# Altium schematic sheet 22_LMS2_TX_BB_DACs.SchDoc: LMS2 TX BB DACs
size A3; Organization: Lime Microsystems; Address1: Surrey Tech Centre; Address2: Guildford GU2 7YG; Address3: Surrey; Address4: United Kingdom; Revision: v1.0; SheetNumber: 22; SheetTotal: 31
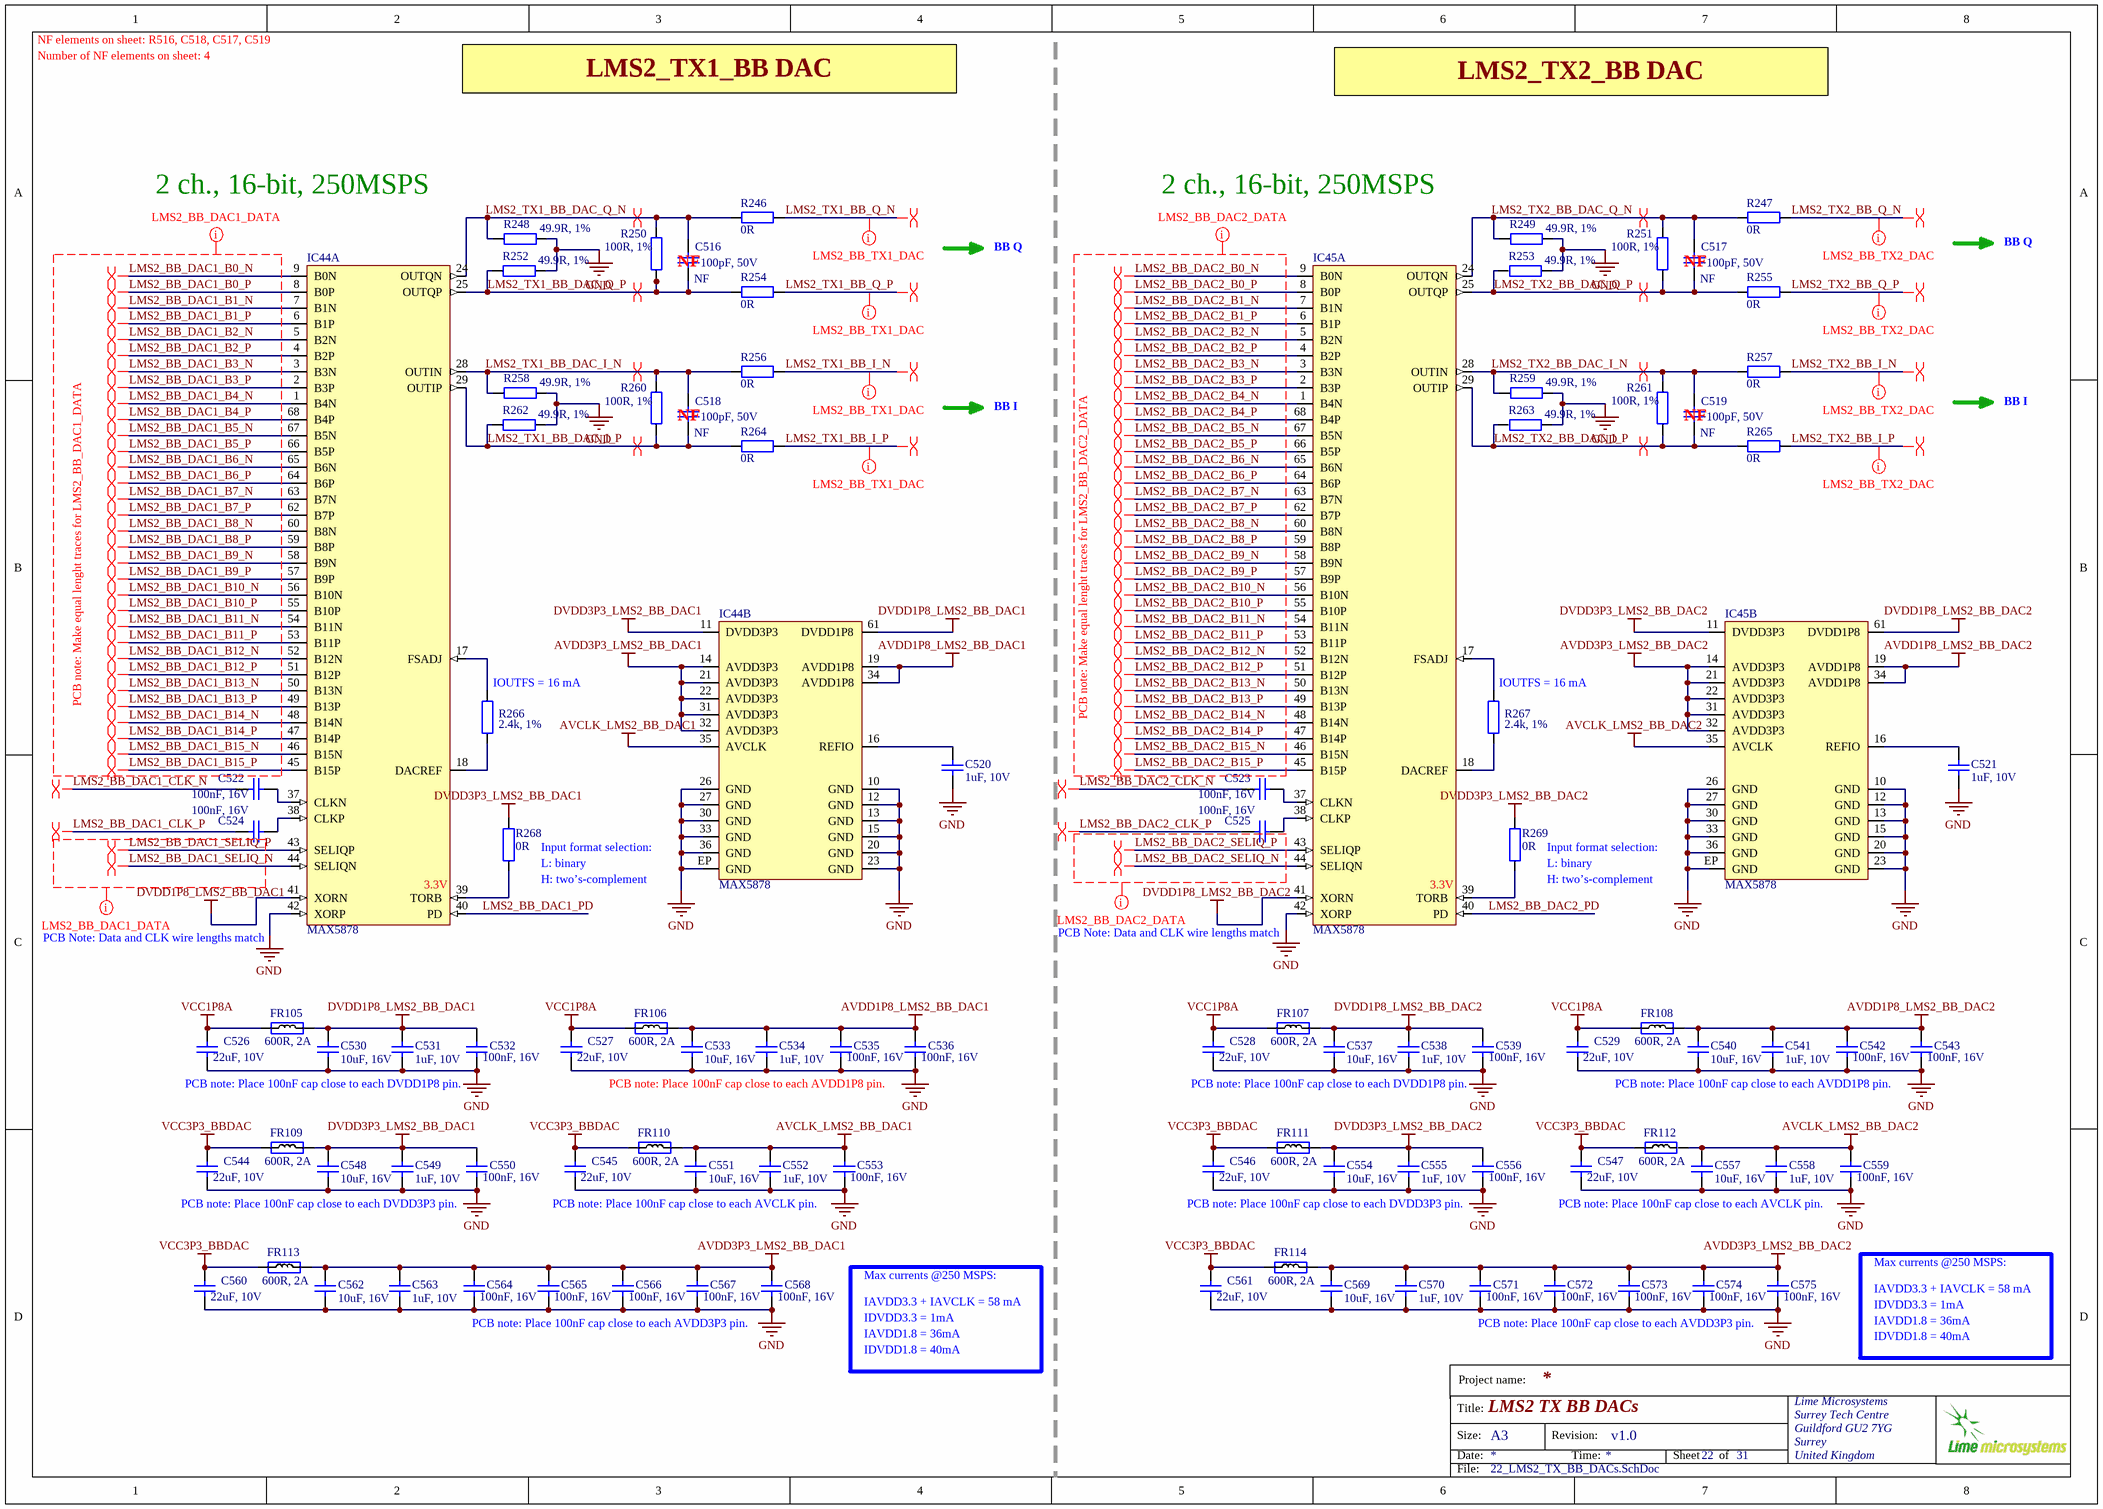
[diagram p0: 22_LMS2_TX_BB_DACs.SchDoc]

## Parts
C516  100pF, 50V  Assembly Info: NF  [CAP0402]
C517  100pF, 50V  Assembly Info: NF  [CAP0402]
C518  100pF, 50V  Assembly Info: NF  [CAP0402]
C519  100pF, 50V  Assembly Info: NF  [CAP0402]
C520  1uF, 10V  [CAP0402]
C521  1uF, 10V  [CAP0402]
C522  100nF, 16V  [CAP0402]
C523  100nF, 16V  [CAP0402]
C524  100nF, 16V  [CAP0402]
C525  100nF, 16V  [CAP0402]
C526  22uF, 10V  [CAP0603]
C527  22uF, 10V  [CAP0603]
C528  22uF, 10V  [CAP0603]
C529  22uF, 10V  [CAP0603]
C530  10uF, 16V  [CAP0603]
C531  1uF, 10V  [CAP0402]
C532  100nF, 16V  [CAP0402]
C533  10uF, 16V  [CAP0603]
C534  1uF, 10V  [CAP0402]
C535  100nF, 16V  [CAP0402]
C536  100nF, 16V  [CAP0402]
C537  10uF, 16V  [CAP0603]
C538  1uF, 10V  [CAP0402]
C539  100nF, 16V  [CAP0402]
C540  10uF, 16V  [CAP0603]
C541  1uF, 10V  [CAP0402]
C542  100nF, 16V  [CAP0402]
C543  100nF, 16V  [CAP0402]
C544  22uF, 10V  [CAP0603]
C545  22uF, 10V  [CAP0603]
C546  22uF, 10V  [CAP0603]
C547  22uF, 10V  [CAP0603]
C548  10uF, 16V  [CAP0603]
C549  1uF, 10V  [CAP0402]
C550  100nF, 16V  [CAP0402]
C551  10uF, 16V  [CAP0603]
C552  1uF, 10V  [CAP0402]
C553  100nF, 16V  [CAP0402]
C554  10uF, 16V  [CAP0603]
C555  1uF, 10V  [CAP0402]
C556  100nF, 16V  [CAP0402]
C557  10uF, 16V  [CAP0603]
C558  1uF, 10V  [CAP0402]
C559  100nF, 16V  [CAP0402]
C560  22uF, 10V  [CAP0603]
C561  22uF, 10V  [CAP0603]
C562  10uF, 16V  [CAP0603]
C563  1uF, 10V  [CAP0402]
C564  100nF, 16V  [CAP0402]
C565  100nF, 16V  [CAP0402]
C566  100nF, 16V  [CAP0402]
C567  100nF, 16V  [CAP0402]
C568  100nF, 16V  [CAP0402]
C569  10uF, 16V  [CAP0603]
C570  1uF, 10V  [CAP0402]
C571  100nF, 16V  [CAP0402]
C572  100nF, 16V  [CAP0402]
C573  100nF, 16V  [CAP0402]
C574  100nF, 16V  [CAP0402]
C575  100nF, 16V  [CAP0402]
FR105  600R, 2A  [RES0805]
FR106  600R, 2A  [RES0805]
FR107  600R, 2A  [RES0805]
FR108  600R, 2A  [RES0805]
FR109  600R, 2A  [RES0805]
FR110  600R, 2A  [RES0805]
FR111  600R, 2A  [RES0805]
FR112  600R, 2A  [RES0805]
FR113  600R, 2A  [RES0805]
FR114  600R, 2A  [RES0805]
IC44  MAX5878  [MAX5878_QFN68]  (parts A,B of 2)
IC45  MAX5878  [MAX5878_QFN68]  (parts A,B of 2)
R246  0R  [RES0402]
R247  0R  [RES0402]
R248  49.9R, 1%  [RES0402]
R249  49.9R, 1%  [RES0402]
R250  100R, 1%  [RES0402]
R251  100R, 1%  [RES0402]
R252  49.9R, 1%  [RES0402]
R253  49.9R, 1%  [RES0402]
R254  0R  [RES0402]
R255  0R  [RES0402]
R256  0R  [RES0402]
R257  0R  [RES0402]
R258  49.9R, 1%  [RES0402]
R259  49.9R, 1%  [RES0402]
R260  100R, 1%  [RES0402]
R261  100R, 1%  [RES0402]
R262  49.9R, 1%  [RES0402]
R263  49.9R, 1%  [RES0402]
R264  0R  [RES0402]
R265  0R  [RES0402]
R266  2.4k, 1%  [RES0402]
R267  2.4k, 1%  [RES0402]
R268  0R  [RES0402]
R269  0R  [RES0402]

## Nets
AVCLK_LMS2_BB_DAC1: C551.2 C552.2 C553.2 FR110.2 IC44.35(AVCLK)
AVCLK_LMS2_BB_DAC2: C557.2 C558.2 C559.2 FR112.2 IC45.35(AVCLK)
AVDD1P8_LMS2_BB_DAC1: C533.2 C534.2 C535.2 C536.2 FR106.2 IC44.19(AVDD1P8) IC44.34(AVDD1P8)
AVDD1P8_LMS2_BB_DAC2: C540.2 C541.2 C542.2 C543.2 FR108.2 IC45.19(AVDD1P8) IC45.34(AVDD1P8)
AVDD3P3_LMS2_BB_DAC1: C562.2 C563.2 C564.2 C565.2 C566.2 C567.2 C568.2 FR113.2 IC44.14(AVDD3P3) IC44.21(AVDD3P3) IC44.22(AVDD3P3) IC44.31(AVDD3P3) IC44.32(AVDD3P3)
AVDD3P3_LMS2_BB_DAC2: C569.2 C570.2 C571.2 C572.2 C573.2 C574.2 C575.2 FR114.2 IC45.14(AVDD3P3) IC45.21(AVDD3P3) IC45.22(AVDD3P3) IC45.31(AVDD3P3) IC45.32(AVDD3P3)
DVDD1P8_LMS2_BB_DAC1: C530.2 C531.2 C532.2 FR105.2 IC44.41(XORN) IC44.61(DVDD1P8)
DVDD1P8_LMS2_BB_DAC2: C537.2 C538.2 C539.2 FR107.2 IC45.41(XORN) IC45.61(DVDD1P8)
DVDD3P3_LMS2_BB_DAC1: C548.2 C549.2 C550.2 FR109.2 IC44.11(DVDD3P3) R268.2
DVDD3P3_LMS2_BB_DAC2: C554.2 C555.2 C556.2 FR111.2 IC45.11(DVDD3P3) R269.2
GND: C520.1 C521.1 C526.1 C527.1 C528.1 C529.1 C530.1 C531.1 C532.1 C533.1 C534.1 C535.1 C536.1 C537.1 C538.1 C539.1 C540.1 C541.1 C542.1 C543.1 C544.1 C545.1 C546.1 C547.1 C548.1 C549.1 C550.1 C551.1 C552.1 C553.1 C554.1 C555.1 C556.1 C557.1 C558.1 C559.1 C560.1 C561.1 C562.1 C563.1 C564.1 C565.1 C566.1 C567.1 C568.1 C569.1 C570.1 C571.1 C572.1 C573.1 C574.1 C575.1 IC44.10(GND) IC44.12(GND) IC44.13(GND) IC44.15(GND) IC44.20(GND) IC44.23(GND) IC44.26(GND) IC44.27(GND) IC44.30(GND) IC44.33(GND) IC44.36(GND) IC44.42(XORP) IC44.EP(GND) IC45.10(GND) IC45.12(GND) IC45.13(GND) IC45.15(GND) IC45.20(GND) IC45.23(GND) IC45.26(GND) IC45.27(GND) IC45.30(GND) IC45.33(GND) IC45.36(GND) IC45.42(XORP) IC45.EP(GND) R248.1 R249.1 R252.1 R253.1 R258.1 R259.1 R262.1 R263.1
VCC1P8A: C526.2 C527.2 C528.2 C529.2 FR105.1 FR106.1 FR107.1 FR108.1
VCC3P3_BBDAC: C544.2 C545.2 C546.2 C547.2 C560.2 C561.2 FR109.1 FR110.1 FR111.1 FR112.1 FR113.1 FR114.1
LMS2_BB_DAC1_B0_N: IC44.9(B0N)
LMS2_BB_DAC1_B0_P: IC44.8(B0P)
LMS2_BB_DAC1_B1_N: IC44.7(B1N)
LMS2_BB_DAC1_B1_P: IC44.6(B1P)
LMS2_BB_DAC1_B2_N: IC44.5(B2N)
LMS2_BB_DAC1_B2_P: IC44.4(B2P)
LMS2_BB_DAC1_B3_N: IC44.3(B3N)
LMS2_BB_DAC1_B3_P: IC44.2(B3P)
LMS2_BB_DAC1_B4_N: IC44.1(B4N)
LMS2_BB_DAC1_B4_P: IC44.68(B4P)
LMS2_BB_DAC1_B5_N: IC44.67(B5N)
LMS2_BB_DAC1_B5_P: IC44.66(B5P)
LMS2_BB_DAC1_B6_N: IC44.65(B6N)
LMS2_BB_DAC1_B6_P: IC44.64(B6P)
LMS2_BB_DAC1_B7_N: IC44.63(B7N)
LMS2_BB_DAC1_B7_P: IC44.62(B7P)
LMS2_BB_DAC1_B8_N: IC44.60(B8N)
LMS2_BB_DAC1_B8_P: IC44.59(B8P)
LMS2_BB_DAC1_B9_N: IC44.58(B9N)
LMS2_BB_DAC1_B9_P: IC44.57(B9P)
LMS2_BB_DAC1_B10_N: IC44.56(B10N)
LMS2_BB_DAC1_B10_P: IC44.55(B10P)
LMS2_BB_DAC1_B11_N: IC44.54(B11N)
LMS2_BB_DAC1_B11_P: IC44.53(B11P)
LMS2_BB_DAC1_B12_N: IC44.52(B12N)
LMS2_BB_DAC1_B12_P: IC44.51(B12P)
LMS2_BB_DAC1_B13_N: IC44.50(B13N)
LMS2_BB_DAC1_B13_P: IC44.49(B13P)
LMS2_BB_DAC1_B14_N: IC44.48(B14N)
LMS2_BB_DAC1_B14_P: IC44.47(B14P)
LMS2_BB_DAC1_B15_N: IC44.46(B15N)
LMS2_BB_DAC1_B15_P: IC44.45(B15P)
LMS2_BB_DAC1_CLK_N: C522.2
LMS2_BB_DAC1_CLK_P: C524.2
LMS2_BB_DAC1_PD: IC44.40(PD)
LMS2_BB_DAC1_SELIQ_N: IC44.44(SELIQN)
LMS2_BB_DAC1_SELIQ_P: IC44.43(SELIQP)
LMS2_BB_DAC2_B0_N: IC45.9(B0N)
LMS2_BB_DAC2_B0_P: IC45.8(B0P)
LMS2_BB_DAC2_B1_N: IC45.7(B1N)
LMS2_BB_DAC2_B1_P: IC45.6(B1P)
LMS2_BB_DAC2_B2_N: IC45.5(B2N)
LMS2_BB_DAC2_B2_P: IC45.4(B2P)
LMS2_BB_DAC2_B3_N: IC45.3(B3N)
LMS2_BB_DAC2_B3_P: IC45.2(B3P)
LMS2_BB_DAC2_B4_N: IC45.1(B4N)
LMS2_BB_DAC2_B4_P: IC45.68(B4P)
LMS2_BB_DAC2_B5_N: IC45.67(B5N)
LMS2_BB_DAC2_B5_P: IC45.66(B5P)
LMS2_BB_DAC2_B6_N: IC45.65(B6N)
LMS2_BB_DAC2_B6_P: IC45.64(B6P)
LMS2_BB_DAC2_B7_N: IC45.63(B7N)
LMS2_BB_DAC2_B7_P: IC45.62(B7P)
LMS2_BB_DAC2_B8_N: IC45.60(B8N)
LMS2_BB_DAC2_B8_P: IC45.59(B8P)
LMS2_BB_DAC2_B9_N: IC45.58(B9N)
LMS2_BB_DAC2_B9_P: IC45.57(B9P)
LMS2_BB_DAC2_B10_N: IC45.56(B10N)
LMS2_BB_DAC2_B10_P: IC45.55(B10P)
LMS2_BB_DAC2_B11_N: IC45.54(B11N)
LMS2_BB_DAC2_B11_P: IC45.53(B11P)
LMS2_BB_DAC2_B12_N: IC45.52(B12N)
LMS2_BB_DAC2_B12_P: IC45.51(B12P)
LMS2_BB_DAC2_B13_N: IC45.50(B13N)
LMS2_BB_DAC2_B13_P: IC45.49(B13P)
LMS2_BB_DAC2_B14_N: IC45.48(B14N)
LMS2_BB_DAC2_B14_P: IC45.47(B14P)
LMS2_BB_DAC2_B15_N: IC45.46(B15N)
LMS2_BB_DAC2_B15_P: IC45.45(B15P)
LMS2_BB_DAC2_CLK_N: C523.2
LMS2_BB_DAC2_CLK_P: C525.2
LMS2_BB_DAC2_PD: IC45.40(PD)
LMS2_BB_DAC2_SELIQ_N: IC45.44(SELIQN)
LMS2_BB_DAC2_SELIQ_P: IC45.43(SELIQP)
LMS2_TX1_BB_DAC_I_N: C518.1 IC44.28(OUTIN) R256.1 R258.2 R260.1
LMS2_TX1_BB_DAC_I_P: C518.2 IC44.29(OUTIP) R260.2 R262.2 R264.1
LMS2_TX1_BB_DAC_Q_N: C516.1 IC44.24(OUTQN) R246.1 R248.2 R250.1
LMS2_TX1_BB_DAC_Q_P: C516.2 IC44.25(OUTQP) R250.2 R252.2 R254.1
LMS2_TX1_BB_I_N: R256.2
LMS2_TX1_BB_I_P: R264.2
LMS2_TX1_BB_Q_N: R246.2
LMS2_TX1_BB_Q_P: R254.2
LMS2_TX2_BB_DAC_I_N: C519.1 IC45.28(OUTIN) R257.1 R259.2 R261.1
LMS2_TX2_BB_DAC_I_P: C519.2 IC45.29(OUTIP) R261.2 R263.2 R265.1
LMS2_TX2_BB_DAC_Q_N: C517.1 IC45.24(OUTQN) R247.1 R249.2 R251.1
LMS2_TX2_BB_DAC_Q_P: C517.2 IC45.25(OUTQP) R251.2 R253.2 R255.1
LMS2_TX2_BB_I_N: R257.2
LMS2_TX2_BB_I_P: R265.2
LMS2_TX2_BB_Q_N: R247.2
LMS2_TX2_BB_Q_P: R255.2
NetC520_2: C520.2 IC44.16(REFIO)
NetC521_2: C521.2 IC45.16(REFIO)
NetC522_1: C522.1 IC44.37(CLKN)
NetC523_1: C523.1 IC45.37(CLKN)
NetC524_1: C524.1 IC44.38(CLKP)
NetC525_1: C525.1 IC45.38(CLKP)
NetIC44_17: IC44.17(FSADJ) R266.2
NetIC44_18: IC44.18(DACREF) R266.1
NetIC44_39: IC44.39(TORB) R268.1
NetIC45_17: IC45.17(FSADJ) R267.2
NetIC45_18: IC45.18(DACREF) R267.1
NetIC45_39: IC45.39(TORB) R269.1

## Layout directives
differential pair: LMS2_BB_DAC1_B0_N, LMS2_BB_DAC1_B0_P, LMS2_BB_DAC1_B1_N, LMS2_BB_DAC1_B1_P, LMS2_BB_DAC1_B2_N, LMS2_BB_DAC1_B2_P, LMS2_BB_DAC1_B3_N, LMS2_BB_DAC1_B3_P, LMS2_BB_DAC1_B4_N, LMS2_BB_DAC1_B4_P, LMS2_BB_DAC1_B5_N, LMS2_BB_DAC1_B5_P, LMS2_BB_DAC1_B6_N, LMS2_BB_DAC1_B6_P, LMS2_BB_DAC1_B7_N, LMS2_BB_DAC1_B7_P, LMS2_BB_DAC1_B8_N, LMS2_BB_DAC1_B8_P, LMS2_BB_DAC1_B9_N, LMS2_BB_DAC1_B9_P, LMS2_BB_DAC1_B10_N, LMS2_BB_DAC1_B10_P, LMS2_BB_DAC1_B11_N, LMS2_BB_DAC1_B11_P, LMS2_BB_DAC1_B12_N, LMS2_BB_DAC1_B12_P, LMS2_BB_DAC1_B13_N, LMS2_BB_DAC1_B13_P, LMS2_BB_DAC1_B14_N, LMS2_BB_DAC1_B14_P, LMS2_BB_DAC1_B15_N, LMS2_BB_DAC1_B15_P, LMS2_BB_DAC1_CLK_N, LMS2_BB_DAC1_CLK_P, LMS2_BB_DAC1_SELIQ_N, LMS2_BB_DAC1_SELIQ_P, LMS2_BB_DAC2_B0_N, LMS2_BB_DAC2_B0_P, LMS2_BB_DAC2_B1_N, LMS2_BB_DAC2_B1_P, LMS2_BB_DAC2_B2_N, LMS2_BB_DAC2_B2_P, LMS2_BB_DAC2_B3_N, LMS2_BB_DAC2_B3_P, LMS2_BB_DAC2_B4_N, LMS2_BB_DAC2_B4_P, LMS2_BB_DAC2_B5_N, LMS2_BB_DAC2_B5_P, LMS2_BB_DAC2_B6_N, LMS2_BB_DAC2_B6_P, LMS2_BB_DAC2_B7_N, LMS2_BB_DAC2_B7_P, LMS2_BB_DAC2_B8_N, LMS2_BB_DAC2_B8_P, LMS2_BB_DAC2_B9_N, LMS2_BB_DAC2_B9_P, LMS2_BB_DAC2_B10_N, LMS2_BB_DAC2_B10_P, LMS2_BB_DAC2_B11_N, LMS2_BB_DAC2_B11_P, LMS2_BB_DAC2_B12_N, LMS2_BB_DAC2_B12_P, LMS2_BB_DAC2_B13_N, LMS2_BB_DAC2_B13_P, LMS2_BB_DAC2_B14_N, LMS2_BB_DAC2_B14_P, LMS2_BB_DAC2_B15_N, LMS2_BB_DAC2_B15_P, LMS2_BB_DAC2_CLK_N, LMS2_BB_DAC2_CLK_P, LMS2_BB_DAC2_SELIQ_N, LMS2_BB_DAC2_SELIQ_P, LMS2_TX1_BB_DAC_I_N, LMS2_TX1_BB_DAC_I_P, LMS2_TX1_BB_DAC_Q_N, LMS2_TX1_BB_DAC_Q_P, LMS2_TX1_BB_I_N, LMS2_TX1_BB_I_P, LMS2_TX1_BB_Q_N, LMS2_TX1_BB_Q_P, LMS2_TX2_BB_DAC_I_N, LMS2_TX2_BB_DAC_I_P, LMS2_TX2_BB_DAC_Q_N, LMS2_TX2_BB_DAC_Q_P, LMS2_TX2_BB_I_N, LMS2_TX2_BB_I_P, LMS2_TX2_BB_Q_N, LMS2_TX2_BB_Q_P
net class LMS2_BB_DAC1_DATA: LMS2_BB_DAC1_B0_N, LMS2_BB_DAC1_B0_P, LMS2_BB_DAC1_B1_N, LMS2_BB_DAC1_B1_P, LMS2_BB_DAC1_B2_N, LMS2_BB_DAC1_B2_P, LMS2_BB_DAC1_B3_N, LMS2_BB_DAC1_B3_P, LMS2_BB_DAC1_B4_N, LMS2_BB_DAC1_B4_P, LMS2_BB_DAC1_B5_N, LMS2_BB_DAC1_B5_P, LMS2_BB_DAC1_B6_N, LMS2_BB_DAC1_B6_P, LMS2_BB_DAC1_B7_N, LMS2_BB_DAC1_B7_P, LMS2_BB_DAC1_B8_N, LMS2_BB_DAC1_B8_P, LMS2_BB_DAC1_B9_N, LMS2_BB_DAC1_B9_P, LMS2_BB_DAC1_B10_N, LMS2_BB_DAC1_B10_P, LMS2_BB_DAC1_B11_N, LMS2_BB_DAC1_B11_P, LMS2_BB_DAC1_B12_N, LMS2_BB_DAC1_B12_P, LMS2_BB_DAC1_B13_N, LMS2_BB_DAC1_B13_P, LMS2_BB_DAC1_B14_N, LMS2_BB_DAC1_B14_P, LMS2_BB_DAC1_B15_N, LMS2_BB_DAC1_B15_P, LMS2_BB_DAC1_SELIQ_N, LMS2_BB_DAC1_SELIQ_P
net class LMS2_BB_DAC2_DATA: LMS2_BB_DAC2_B0_N, LMS2_BB_DAC2_B0_P, LMS2_BB_DAC2_B1_N, LMS2_BB_DAC2_B1_P, LMS2_BB_DAC2_B2_N, LMS2_BB_DAC2_B2_P, LMS2_BB_DAC2_B3_N, LMS2_BB_DAC2_B3_P, LMS2_BB_DAC2_B4_N, LMS2_BB_DAC2_B4_P, LMS2_BB_DAC2_B5_N, LMS2_BB_DAC2_B5_P, LMS2_BB_DAC2_B6_N, LMS2_BB_DAC2_B6_P, LMS2_BB_DAC2_B7_N, LMS2_BB_DAC2_B7_P, LMS2_BB_DAC2_B8_N, LMS2_BB_DAC2_B8_P, LMS2_BB_DAC2_B9_N, LMS2_BB_DAC2_B9_P, LMS2_BB_DAC2_B10_N, LMS2_BB_DAC2_B10_P, LMS2_BB_DAC2_B11_N, LMS2_BB_DAC2_B11_P, LMS2_BB_DAC2_B12_N, LMS2_BB_DAC2_B12_P, LMS2_BB_DAC2_B13_N, LMS2_BB_DAC2_B13_P, LMS2_BB_DAC2_B14_N, LMS2_BB_DAC2_B14_P, LMS2_BB_DAC2_B15_N, LMS2_BB_DAC2_B15_P, LMS2_BB_DAC2_SELIQ_N, LMS2_BB_DAC2_SELIQ_P
net class LMS2_BB_TX2_DAC: LMS2_TX2_BB_I_N, LMS2_TX2_BB_I_P, LMS2_TX2_BB_Q_N, LMS2_TX2_BB_Q_P
net class LMS2_BB_TX1_DAC: LMS2_TX1_BB_I_N, LMS2_TX1_BB_I_P, LMS2_TX1_BB_Q_N, LMS2_TX1_BB_Q_P

## Notes on the sheet
- NF elements on sheet: R516, C518, C517, C519
- Number of NF elements on sheet: 4
- LMS2_TX1_BB DAC
- LMS2_TX2_BB DAC
- (near R248) 2 ch., 16-bit, 250MSPS
- BB Q
- (near R249) 2 ch., 16-bit, 250MSPS
- (near C516) NF
- (near C517) NF
- (near C518) NF
- BB I
- (near C519) NF
- PCB note: Make equal lenght traces for LMS2_BB_DAC1_DATA
- (near R266) IOUTFS = 16 mA
- PCB note: Make equal lenght traces for LMS2_BB_DAC2_DATA
- (near R267) IOUTFS = 16 mA
- Input format selection:
- (near IC44) 3.3V
- (near R268) L: binary
- (near R268) H: two’s-complement
- (near IC45) 3.3V
- (near R269) L: binary
- (near R269) H: two’s-complement
- (near IC44) PCB Note: Data and CLK wire lengths match
- (near IC45) PCB Note: Data and CLK wire lengths match
- PCB note: Place 100nF cap close to each DVDD1P8 pin.
- PCB note: Place 100nF cap close to each AVDD1P8 pin.
- PCB note: Place 100nF cap close to each DVDD3P3 pin.
- PCB note: Place 100nF cap close to each AVCLK pin.
- PCB note: Place 100nF cap close to each AVDD3P3 pin.
- IAVDD3.3 + IAVCLK = 58 mA
- IDVDD3.3 = 1mA
- Max currents @250 MSPS:
- IAVDD1.8 = 36mA
- IDVDD1.8 = 40mA
- Project name:
- Title:
- Size:
- Date:
- A3
- Revision:
- Time:
- Sheet
- of
- File:

## Library data of the parts
C516-C519 = Cap_0402: Manufacturer Part Number 1: CC0402JRNPO9BN101; Manufacturer: Yageo; Part Description: 100pF ±5% 50V C0G, NP0 Ceramic Capacitor -55°C ~ 125°C Surface Mount, MLCC 0402 (1005 Metric) 0.039" L x 0.020" W (1.00mm x 0.50mm); Tolerance: ±5%; Temperature Coefficient: C0G, NP0; Value: 100pF, 50V; Capacitance: 100pF; Thickness (Max): 0.022" (0.55mm); Size / Dimension: 0.039" L x 0.020" W (1.00mm x 0.50mm); RoHS: RoHS Compliant; Ratings: -; Package / Case: 0402 (1005 Metric); Mounting Type: Surface Mount, MLCC; Height - Seated (Max): -; Features: -; Lead Spacing: -; Voltage - Rated: 50V; Operating Temperature: -55°C ~ 125°C; Packaging: Cut Tape (CT); Applications: General Purpose; Lead Style: -; Supplier 1: Digi-Key; Category: Capacitors; Supplier Part Number 1: 311-1024-1-ND
C520 C521 C531 C534 C538 C541 C549 C552 C555 C558 C563 C570 = Cap_0402: Manufacturer Part Number 1: C1005X5R1E105K050BC; Manufacturer: TDK; Part Description: 1µF ±10% 10V X5R Ceramic Capacitor -55°C ~ 85°C Surface Mount, MLCC 0402 (1005 Metric) 0.039" L x 0.020" W (1.00mm x 0.50mm); Voltage Rating: 10; Capacitance Tolerance: ± 10%; Product Range: TDK - C Series; Ceramic Capacitor Case: 0402 [1005 Metric]; Capacitance: 1; Dielectric Characteristic: X6; Value: 1uF, 10V; Supplier 1: Digi-Key; Supplier Part Number 1: 445-9066-1-ND; MSL: -; RoHS: YES
C522-C525 C532 C535 C536 C539 C542 C543 C550 C553 C556 C559 C564-C568 C571-C575 = Cap_0603: Part Description: 0.10µF ±10% 16V X7R Ceramic Capacitor -55°C ~ 125°C Surface Mount, MLCC 0402 (1005 Metric) 0.039" L x 0.020" W (1.00mm x 0.50mm); Manufacturer Part Number 1: GRM155R71C104KA88D; Brand: Murata Electronics; Tolerance: 10 %; Type: General Purpose MLCC; Capacitance: 0.1 uF; Temperature Coefficient / Code: +/- 15 %; Case Height: 0.5 mm; Case Length: 1 mm; Dielectric: X7R; Supplier 1: Mouser; Supplier Part Number 1: 81-GRM155R71C104KA88; Case Code - in: 0402; Manufacturer: Murata Electronics; Category: Multilayer Ceramic Capacitors MLCC - SMD/SMT; Voltage Rating DC: 16 V; Value: 100nF, 16V; Case Code - mm: 1005; Case Width: 0.5 mm; Maximum Operating Temperature: + 125 C; Minimum Operating Temperature: - 55 C; Minimum Order Quantity: 1; Operating Temperature Range: - 55 C to + 125 C; Package / Case: 0402 (1005 metric); Packaging: Reel; Product: General Type MLCCs; Product Category: Low & Medium Capacitance SMD Ceramic Chip Capacitors; Reeling: True; RoHS - Mouser: Y; RoHS: RoHS Compliant; Series: GRM; Standard Pack Qty: 10000; Termination Style: SMD/SMT
C526-C529 C544-C547 C560 C561 = Cap_0603: Manufacturer Part Number 1: C1608X5R1A226M080AC; Part Description: 22µF ±20% 10V Ceramic Capacitor X5R 0603 (1608 Metric); Manufacturer: TDK Corporation; Brand: TDK; Temperature Coefficient / Code: +/- 15 %; Tolerance: 20 %; Type: Multilayer Ceramic Chip Capacitor; Supplier 1: Mouser; Supplier Part Number 1: 810-C1608X5R1A226M; Package / Case: 0603 (1608 metric); Category: Multilayer Ceramic Capacitors MLCC - SMD/SMT; Capacitance: 22 uF; Operating Temperature Range: - 55 C to + 85 C; Case Code - in: 0603; Voltage Rating DC: 10 V; Case Code - mm: 1608; Value: 22uF, 10V
C530 C533 C537 C540 C548 C551 C554 C557 C562 C569 = Cap_0603: Manufacturer: Yageo; Manufacturer Part Number 1: GRM188R61C106MA73D; Part Description: 10µF ±20% 16V Ceramic Capacitor X5R 0603 (1608 Metric); Temperature Coefficient: X5R; Capacitance: 10µF; Tolerance: ±20%; Value: 10uF, 16V; Supplier 1: Digi-Key; Supplier Part Number 1: 490-7201-2-ND; Category: Capacitors; Ratings: -; Features: -; Lead Style: -; Package / Case: 0603 (1608 Metric); Lead Spacing: -; Applications: General Purpose; Voltage - Rated: 16V; Operating Temperature: -55°C ~ 85°C; Thickness (Max): 0.039" (1.00mm); Mounting Type: Surface Mount, MLCC; RoHS: RoHS Compliant; Size / Dimension: 0.063" L x 0.031" W (1.60mm x 0.80mm); Packaging: Tape & Reel (TR); Height - Seated (Max): -
FR105-FR114 = Ferrite: Manufacturer Part Number 1: MPZ2012S601AT000; Manufacturer: TDK Corporation; Part Description: FERRITE BEAD 600 OHM 0805 1LN; Filter Type: Differential Mode - Single; Impedance @ Frequency: 600 Ohm @ 100MHz; DC Resistance (DCR): 100 mOhm Max; Supplier 1: Digi-Key; Supplier Part Number 1: 445-2206-2-ND; Mounting Type: Surface Mount; RoHS: RoHS Compliant; Height (Max): 0.041" (1.05mm); Packaging: Tape & Reel (TR); Category: Filters; Current Rating: 2A; Package / Case: 0805 (2012 Metric); Size / Dimension: 0.079" L x 0.049" W (2.00mm x 1.25mm); Value: 600R, 2A
IC44 IC45 = MAX5878EGK: Part Description: 16 Bit Digital to Analog Converter 2 68-QFN-EP (10x10); Manufacturer: Maxim; Manufacturer Part Number 1: MAX5878EGK+D; Max Power Dissipation: 331mW; Number of DAC Channels: 2; Max Supply Voltage: 3.465V; Min Supply Voltage: 3.135V; Interface: Parallel,LVDS; Settling Time: 14ns; Number of Bits: 16; Sampling Rate: 250000000S/s; Resolution: 16b; Supply Type: Analog,Digital; Conversion Rate: 250MS/s; Integral Nonlinearity (INL): 3LSB; Supplier 1: Digi-Key; Supplier Part Number 1: MAX5878EGK+D-ND; Stock 1: 52; Pricing 1: 1=23,84000, 10=21,99000, 25=21,00200, 100=20,44800 (USD); RoHS: Yes; Mount: Surface Mount; Case/Package: QFN; Number of Pins: 68; Min Operating Temperature: -40°C; Max Operating Temperature: 85°C; Packaging: Rail/Tube; Package Quantity: 30; Number of Converters: 2; Radiation Hardening: No; REACH SVHC: Unknown; ComponentLink1URL: https://datasheet.ciiva.com/1399/max5878-1399152.pdf?src-supplier=Digi-Key; ComponentLink1Description: https://datasheet.ciiva.com/1399/max5878-1399152.pdf?src-supplier=Digi-Key; ComponentLink2URL: https://datasheet.ciiva.com/16604/max5878-16604848.pdf?src-supplier=Avnet+Europe; ComponentLink2Description: https://datasheet.ciiva.com/16604/max5878-16604848.pdf?src-supplier=Avnet+Europe; ComponentLink3URL: https://datasheet.ciiva.com/12285/max5878-106739-12285938.pdf?src-supplier=Mouser; ComponentLink3Description: https://datasheet.ciiva.com/12285/max5878-106739-12285938.pdf?src-supplier=Mouser; ComponentLink4URL: https://datasheet.ciiva.com/26805/max5878egk-d-26805730.pdf?src-supplier=IIIC; ComponentLink4Description: https://datasheet.ciiva.com/26805/max5878egk-d-26805730.pdf?src-supplier=IIIC; ComponentLink5URL: https://datasheet.ciiva.com/14250/max5878-14250858.pdf?src-supplier=Avnet; ComponentLink5Description: https://datasheet.ciiva.com/14250/max5878-14250858.pdf?src-supplier=Avnet
R246 R247 R254-R257 R264 R265 R268 R269 = Res_0402: Manufacturer Part Number 1: RC0402JR-070RL; Manufacturer: Yageo; Part Description: RES SMD 0.0OHM JUMPER 1/16W 0402; Resistance (Ohms): 0.0; Tolerance: Jumper; Power (Watts): 0.063W, 1/16W; Value: 0R; Supplier 1: Digi-Key; Supplier Part Number 1: 311-0.0JRTR-ND; Category: Resistors; Temperature Coefficient: -; Features: Moisture Resistant; Supplier Device Package: 0402; Height: 0.016" (0.40mm); Package / Case: 0402 (1005 Metric); Operating Temperature: -55°C ~ 155°C; Size / Dimension: 0.039" L x 0.020" W (1.00mm x 0.50mm); Composition: Thick Film; Packaging: Tape & Reel (TR); Number of Terminations: 2; RoHS: RoHS Compliant
R248 R249 R252 R253 R258 R259 R262 R263 = Res_0402: Manufacturer: Samsung Electro-Mechanics America, Inc.; Part Description: RES SMD 49.9 OHM 1% 1/16W 0402; Manufacturer Part Number 1: RC1005F49R9CS; Temperature Coefficient: ±100ppm/°C; Resistance (Ohms): 49.9; Power (Watts): 0.063W, 1/16W; Number of Terminations: 2; Size / Dimension: 0.039" L x 0.020" W (1.00mm x 0.50mm); Supplier Device Package: 0402 (1005 Metric); RoHS: RoHS Compliant; Supplier Part Number 1: 1276-3469-6-ND; Features: -; Packaging: Digi-Reel®; Tolerance: ±1%; Height: 0.016" (0.40mm); Category: Resistors; Composition: Thick Film; Package / Case: 0402 (1005 Metric); Supplier 1: Digi-Key; Operating Temperature: -55°C ~ 155°C; Value: 49.9R, 1%
R250 R251 R260 R261 = Res_0402: Manufacturer Part Number 1: RMCF0402FT100R; Manufacturer: Stackpole Electronics Inc.; Part Description: RES SMD 100 OHM 1% 1/16W 0402; Power (Watts): 0.063W, 1/16W; Temperature Coefficient: ±100ppm/°C; Resistance (Ohms): 100; Value: 100R, 1%; Supplier 1: Digi-Key; Supplier Part Number 1: RMCF0402FT100RDKR-ND; Packaging: Digi-Reel®; Composition: Thick Film; Number of Terminations: 2; Package / Case: 0402 (1005 Metric); RoHS: RoHS Compliant; Category: Resistors; Size / Dimension: 0.039" L x 0.020" W (1.00mm x 0.50mm); Tolerance: ±1%; Supplier Device Package: 0402; Features: -; Height: 0.016" (0.40mm); Operating Temperature: -55°C ~ 155°C
R266 R267 = Res_0402: Manufacturer Part Number 1: RC0402FR-072K4L; Manufacturer: Yageo; Part Description: 2.4 kOhms ±1% 0.063W, 1/16W Chip Resistor 0402 (1005 Metric) Moisture Resistant Thick Film; Temperature Coefficient: ±100ppm/°C; Power (Watts): 0.063W, 1/16W; Value: 2.4k, 1%; Package / Case: 0402 (1005 Metric); RoHS: RoHS Compliant; Supplier Part Number 1: 311-2.40KLRCT-ND; Resistance (Ohms): 2.4k; Size / Dimension: 0.039" L x 0.020" W (1.00mm x 0.50mm); Category: Resistors; Part Status: Active; Features: Moisture Resistant; Supplier Device Package: 0402; Failure Rate: -; Tolerance: ±1%; Composition: Thick Film; Packaging: Cut Tape (CT); Operating Temperature: -55°C ~ 155°C; Height - Seated (Max): 0.016" (0.40mm); Supplier 1: Digi-Key